# EAGLE schematic janus (EAGLE 7.5.0)
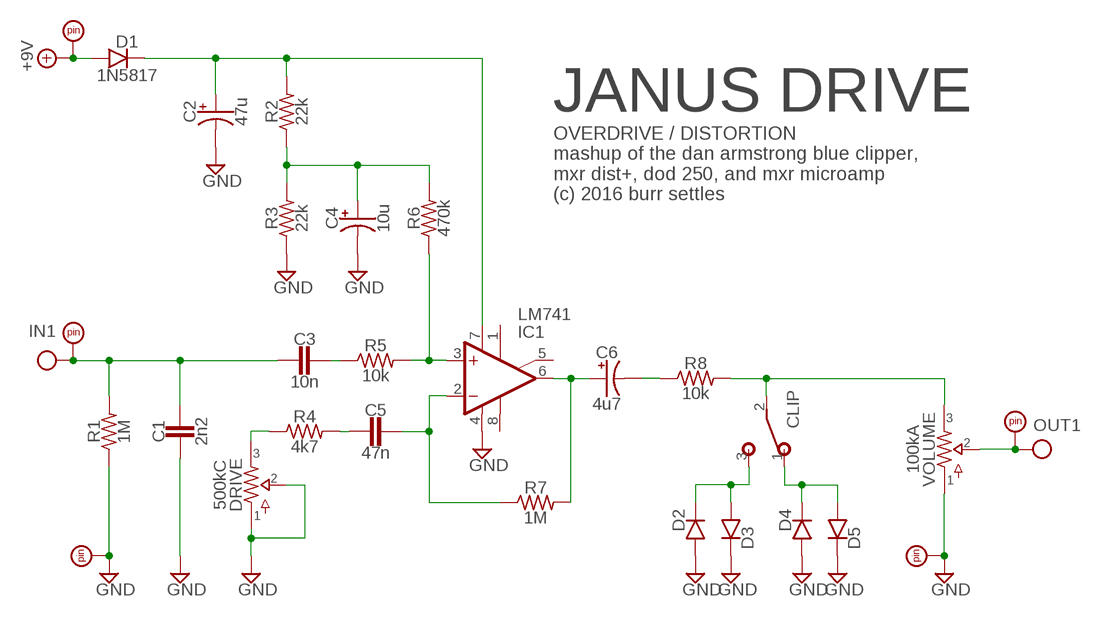
[diagram p0: schematic, sheet 1]

## Parts
C1  2n2  CER/FILMBOX.1  [BOX_SMALL]
C2  47u  0501  [050_020_1]
C3  10n  CER/FILMBOX.1  [BOX_SMALL]
C4  10u  0501  [050_020_1]
C5  47n  CER/FILMBOX.1  [BOX_SMALL]
C6  4u7  0501  [050_020_1]
CLIP  SPDTPADS  [SPDT]
D1  1N5817  DO41.2  [DO41-2]
D2  DO35.2  [DO35-2]
D3  DO35.2  [DO35-2]
D4  DO35.3  [DO35-3]
D5  DO35.3  [DO35-3]
DRIVE  500kC  POTSSMALL_PADS  [PADS_SMALL]
IC1  LM741  SINGLETH  [DIL08]
PAD1  PADSQR  [SQUARE]
PAD2  PADSQR  [SQUARE]
PAD3  PADRND  [ROUND]
PAD4  PADRND  [ROUND]
PAD5  PADSQR  [SQUARE]
R1  1M  R_.3B  [R0207/3]
R2  22k  R_.3B  [R0207/3]
R3  22k  R_.3B  [R0207/3]
R4  4k7  R_.3B  [R0207/3]
R5  10k  R_.3B  [R0207/3]
R6  470k  R_.3B  [R0207/3]
R7  1M  R_.3B  [R0207/3]
R8  10k  R_.3B  [R0207/3]
VOLUME  100kA  POTSSMALL_PADS  [PADS_SMALL]

## Nets
+9V: D1.A PAD1.1
CLIP: CLIP.2(P) R8.2 VOLUME.3
GND: C1.1 C2.- C4.- D2.A D3.C D4.A D5.C DRIVE.1 DRIVE.2 IC1.4(V-) PAD3.1 PAD4.1 R1.1 R3.1 VOLUME.1
IN: C1.2 C3.2 PAD2.1 R1.2
N$1: C3.1 R5.1
N$2: IC1.3(+IN) R5.2 R6.1
N$3: C5.1 IC1.2(-IN) R7.1
N$4: C5.2 R4.2
N$5: C6.+ IC1.6(OUT) R7.2
N$6: C6.- R8.1
N$7: CLIP.3(S) D2.C D3.A
N$8: C4.+ R2.1 R3.2 R6.2
N$9: CLIP.1(O) D4.C D5.A
N$10: DRIVE.3 R4.1
N$12: C2.+ D1.C IC1.7(V+) R2.2
OUT: PAD5.1 VOLUME.2
Unconnected: IC1.1(ON1) IC1.5(ON2) IC1.8(OPT)

## Notes on the sheet
- JANUS DRIVE
- OVERDRIVE / DISTORTION
  mashup of the dan armstrong blue clipper,
  mxr dist+, dod 250, and mxr microamp
  (c) 2016 burr settles

## Library data of the parts
C1 C3 C5 = capacitors-film:CER/FILM: 47 - 120pF Xicon Ceramic Disc 2.5mm lead spacing
C2 C4 C6 = capacitors-elec:050: 0.22 - 100uF Xicon values at Mouser.com: 10V: 10 - 100uF; 16V: 2.2 - 47uF; 25V: 0.47 - 47uF; 50V: 0.22 - 22uF
CLIP = switches:SPDT: TOGGLE SWITCH Marquardt
D1 = diodes:DO41: DO-41 Package Diodes: 1N4001 - 1N40019 Zener Diodes: 1N4728 - 1N4764
D2-D5 = diodes:DO35: DO-35 Package Diodes: 1N914
DRIVE VOLUME = potentiometers:POTS
IC1 = integrated circuits:SINGLE: OP AMP
PAD1-PAD5 = supply pins:PAD
R1-R8 = resistors:R_